# Altium schematic sheet Sch_mcu_brd_external_connectors.SchDoc
size A
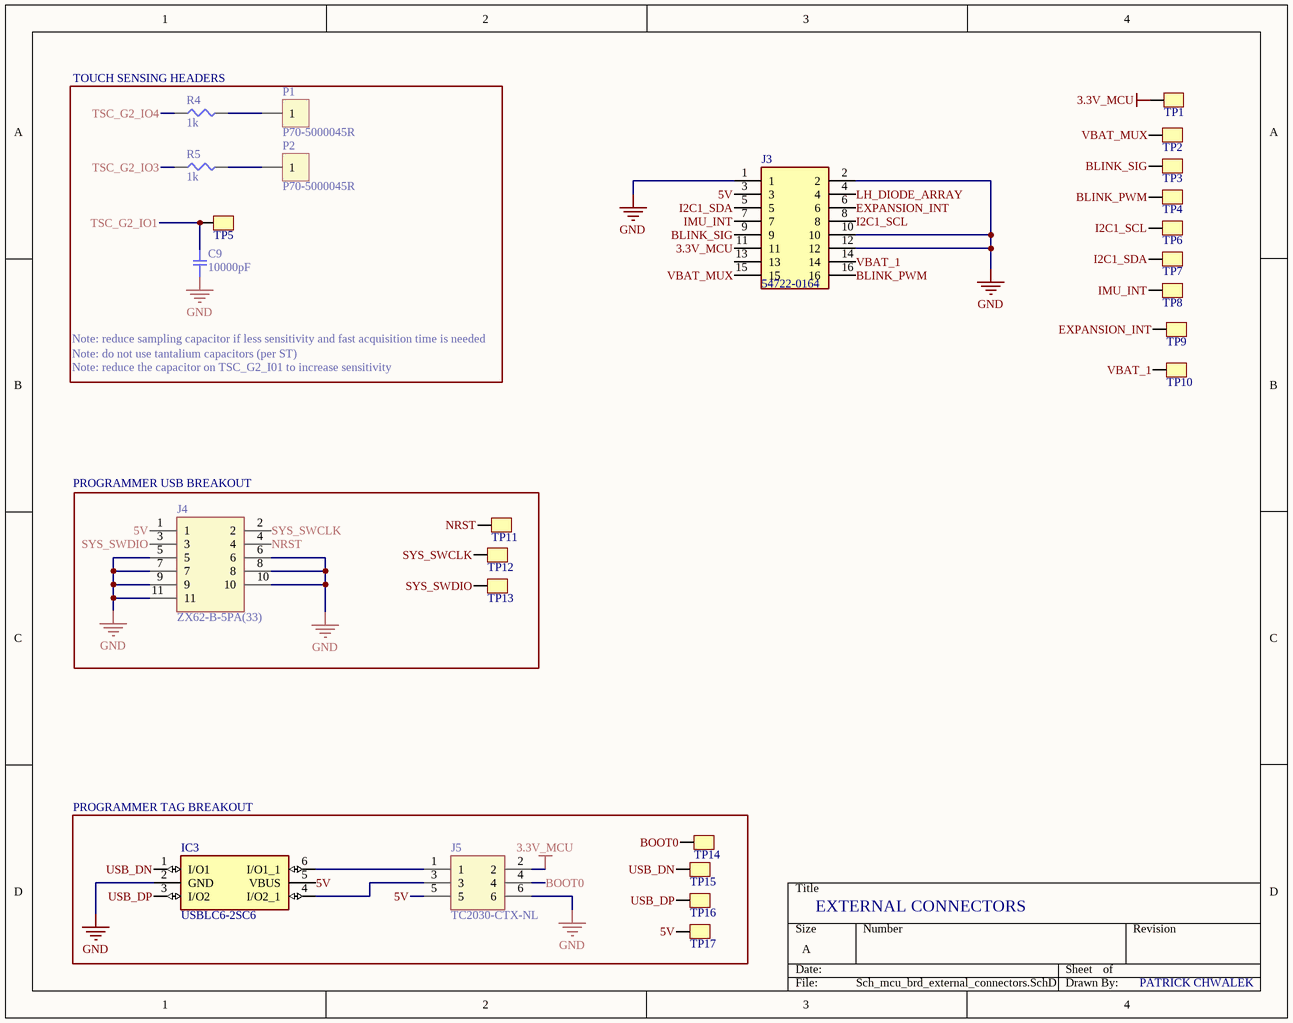
[diagram p0: Sch_mcu_brd_external_connectors.SchDoc]

## Parts
C9  10000pF  [SMD-0402C]
IC3  USBLC6-2SC6  [SOT95P280X145-6N]
J3  54722-0164  [54722-0164]
J4  ZX62-B-5PA(33)  [ZX62B5PA33]
J5  TC2030-CTX-NL  [TC2030MCPNL10]
P1  P70-5000045R  [P70-5000045R]
P2  P70-5000045R  [P70-5000045R]
R4  1k  [SMD-0402-RES]
R5  1k  [SMD-0402-RES]
TP1  TestPoint  [TestPoint_0.4mm]  (value not drawn)
TP2  TestPoint  [TestPoint_0.4mm]  (value not drawn)
TP3  TestPoint  [TestPoint_0.4mm]  (value not drawn)
TP4  TestPoint  [TestPoint_0.4mm]  (value not drawn)
TP5  TestPoint  [TestPoint_0.4mm]  (value not drawn)
TP6  TestPoint  [TestPoint_0.4mm]  (value not drawn)
TP7  TestPoint  [TestPoint_0.4mm]  (value not drawn)
TP8  TestPoint  [TestPoint_0.4mm]  (value not drawn)
TP9  TestPoint  [TestPoint_0.4mm]  (value not drawn)
TP10  TestPoint  [TestPoint_0.4mm]  (value not drawn)
TP11  TestPoint  [TestPoint_0.4mm]  (value not drawn)
TP12  TestPoint  [TestPoint_0.4mm]  (value not drawn)
TP13  TestPoint  [TestPoint_0.4mm]  (value not drawn)
TP14  TestPoint  [TestPoint_0.4mm]  (value not drawn)
TP15  TestPoint  [TestPoint_0.4mm]  (value not drawn)
TP16  TestPoint  [TestPoint_0.4mm]  (value not drawn)
TP17  TestPoint  [TestPoint_0.4mm]  (value not drawn)

## Blocks framed on the sheet
PROGRAMMER USB BREAKOUT: J4 TP11-TP13
PROGRAMMER TAG BREAKOUT: IC3 J5 TP14-TP17

## Nets
3.3V_MCU: J3.11 J5.2 TP1.1
GND: C9.1 IC3.2(GND) J3.1 J3.2 J3.10 J3.12 J4.5 J4.6 J4.7 J4.8 J4.9 J4.10 J4.11 J5.6
5V: IC3.5(VBUS) J3.3 J4.1 J5.5 TP17.1
BLINK_PWM: J3.16 TP4.1
BLINK_SIG: J3.9 TP3.1
BOOT0: J5.4 TP14.1
EXPANSION_INT: J3.6 TP9.1
I2C1_SCL: J3.8 TP6.1
I2C1_SDA: J3.5 TP7.1
IMU_INT: J3.7 TP8.1
LH_DIODE_ARRAY: J3.4
NRST: J4.4 TP11.1
SYS_SWCLK: J4.2 TP12.1
SYS_SWDIO: J4.3 TP13.1
TSC_G2_IO1: C9.2 TP5.1
TSC_G2_IO3: R5.1
TSC_G2_IO4: R4.1
USB_DN: IC3.1(I/O1) TP15.1
USB_DP: IC3.3(I/O2) TP16.1
VBAT_1: J3.14 TP10.1
VBAT_MUX: J3.15 TP2.1
NetIC3_4: IC3.4(I/O2_1) J5.3
NetIC3_6: IC3.6(I/O1_1) J5.1
NetP1_1: P1.1 R4.2
NetP2_1: P2.1 R5.2

Not connected (* = marked no-connect by the designer): J3 13

## Notes on the sheet
- (near R4) TOUCH SENSING HEADERS
- Note: reduce sampling capacitor if less sensitivity and fast acquisition time is needed
- Note: do not use tantalium capacitors (per ST)
- Note: reduce the capacitor on TSC_G2_I01 to increase sensitivity
- EXTERNAL CONNECTORS
- PATRICK CHWALEK

## Library data of the parts
C9 = GCM155R71H103KA55D: CAP CER 10000PF 50V X7R 0402; Manufacturer: Murata Electronics North America; Factory Stock: 0; Unit Price (USD): 0.1; Minimum Quantity: 1; Tolerance: ±10%; Datasheets: http://www.murata.com/~/media/webrenewal/support/library/catalog/products/capacitor/mlcc/c03e.ashx; Image: //media.digikey.com/Renders/Murata%20Renders/ZRB-SERIES-0402.jpg; Digi-Key Part Number: 490-4762-1-ND; Part Number: GCM155R71H103KA55D; Quantity Available: 650067; @ qty: 0; Packaging: Cut Tape (CT); Series: GCM; Part Status: Active; Value: 10000pF; Voltage: 50V; Temperature Coefficient: X7R; Operating Temperature: -55°C ~ 125°C; Features: -; Ratings: AEC-Q200; Applications: Automotive; Mounting Type: Surface Mount, MLCC; Package / Case: 0402 (1005 Metric); Size / Dimension: 0.039" L x 0.020" W (1.00mm x 0.50mm); Height - Seated (Max): -; Thickness (Max): 0.022" (0.55mm); Lead Spacing: -; Lead Style: -
IC3 = USBLC6-2SC6: Integrated Circuit; Manufacturer_Name: STMicroelectronics; Allied_Number: 70389689; Datasheet Link: http://www.st.com/st-web-ui/static/active/en/resource/technical/document/datasheet/CD00050750.pdf; Height: 1.45mm; Manufacturer_Part_Number: USBLC6-2SC6; Mouser Part Number: 511-USBLC6-2SC6; Mouser Price/Stock: https://www.mouser.com/Search/Refine.aspx?Keyword=511-USBLC6-2SC6; RS Part Number: 9206266; RS Price/Stock: https://uk.rs-online.com/web/p/products/9206266; Allied Price/Stock: http://www.alliedelec.com/stmicroelectronics-usblc6-2sc6/70389689/
J3 = 54722-0164: Connector; Manufacturer_Name: Molex; Datasheet Link: http://www.molex.com/webdocs/datasheets/pdf/en-us//0547220164_PCB_RECEPTACLES.pdf; Manufacturer_Part_Number: 54722-0164; Mouser Part Number: 538-54722-0164; Mouser Price/Stock: https://www.mouser.com/Search/Refine.aspx?Keyword=538-54722-0164; RS Part Number: 7206511; RS Price/Stock: https://uk.rs-online.com/web/p/products/7206511
J4 = ZX62-B-5PA(33): Connector; Manufacturer_Name: Hirose; Datasheet Link: http://www.mouser.com/ds/2/185/ZX_catalog-939768.pdf; Height: 2.8mm; Manufacturer_Part_Number: ZX62-B-5PA(33); Mouser Part Number: 798-ZX62-B-5PA33; Mouser Price/Stock: https://www.mouser.com/Search/Refine.aspx?Keyword=798-ZX62-B-5PA33; RS Part Number: 1362267; RS Price/Stock: http://uk.rs-online.com/web/p/products/1362267
J5 = TC2030-CTX-NL: Connector; Manufacturer_Name: Tag Connect; Datasheet Link: http://www.tag-connect.com/Materials/TC2030-CTX.pdf; Height: 18mm; Manufacturer_Part_Number: TC2030-CTX-NL
R4 R5 = ERJ-2GEJ102X: RES SMD 1K OHM 5% 1/10W 0402; Manufacturer: Panasonic Electronic Components; Factory Stock: 0; Unit Price (USD): 0.00350; @ qty: 1500; Minimum Quantity: 1; Power (Watts): 0.1W, 1/10W; Temperature Coefficient: ±200ppm/°C; Part Number: ERJ-2GEJ102X; Datasheets: http://industrial.panasonic.com/www-cgi/jvcr13pz.cgi?E+PZ+3+AOA0001+ERJ2GEJ102X+7+WW; Image: //media.digikey.com/Photos/Panasonic%20Photos/ERJ-PA2-Series.jpg; Digi-Key Part Number: P1.0KJCT-ND; Quantity Available: 1939857; Packaging: Cut Tape (CT); Series: ERJ; Part Status: Active; Value: 1k; Tolerance: ±5%; Composition: Thick Film; Features: Automotive AEC-Q200; Operating Temperature: -55°C ~ 155°C; Package / Case: 0402 (1005 Metric); Supplier Device Package: 0402; Size / Dimension: 0.039" L x 0.020" W (1.00mm x 0.50mm); Height - Seated (Max): 0.016" (0.40mm); Number of Terminations: 2; Failure Rate: -